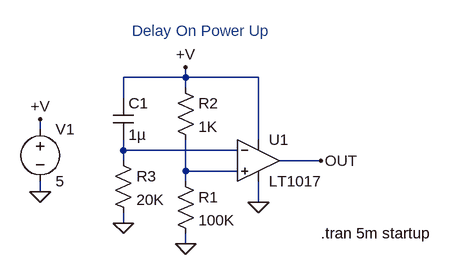
[diagram p0: schematic LT1017.asc]
LT1017.asc, the LTspice schematic file:
Version 4
SHEET 1 880 680
WIRE -208 112 -208 96
WIRE -208 112 -304 112
WIRE -96 112 -208 112
WIRE -208 128 -208 112
WIRE -304 144 -304 112
WIRE -432 192 -432 176
WIRE -96 208 -96 112
WIRE -304 224 -304 208
WIRE -128 224 -304 224
WIRE -304 240 -304 224
WIRE 0 240 -64 240
WIRE -208 256 -208 208
WIRE -128 256 -208 256
WIRE -208 272 -208 256
WIRE -432 288 -432 272
WIRE -96 304 -96 272
WIRE -304 336 -304 320
WIRE -208 368 -208 352
FLAG -432 288 0
FLAG -432 176 +V
FLAG -208 96 +V
FLAG -96 304 0
FLAG -208 368 0
FLAG -304 336 0
FLAG 0 240 OUT
SYMBOL voltage -432 176 R0
SYMATTR InstName V1
SYMATTR Value 5
SYMBOL LT1017 -96 240 R0
SYMATTR InstName U1
SYMBOL res -224 256 R0
SYMATTR InstName R1
SYMATTR Value 100K
SYMBOL res -224 112 R0
SYMATTR InstName R2
SYMATTR Value 1K
SYMBOL res -320 224 R0
SYMATTR InstName R3
SYMATTR Value 20K
SYMBOL cap -320 144 R0
SYMATTR InstName C1
SYMATTR Value 1µ
TEXT 0 352 Left 2 !.tran 5m startup
TEXT -184 56 Bottom 2 ;Delay On Power Up

The netlist it stands for:
* LT1017.asc
V1 +V 0 5
XU1 N002 N001 +V 0 OUT LT1017  ; pins In+ In- V+ V- OUT
R1 N002 0 100K
R2 +V N002 1K
R3 N001 0 20K
C1 +V N001 1µ
.tran 5m startup
* Delay On Power Up
.backanno
.end